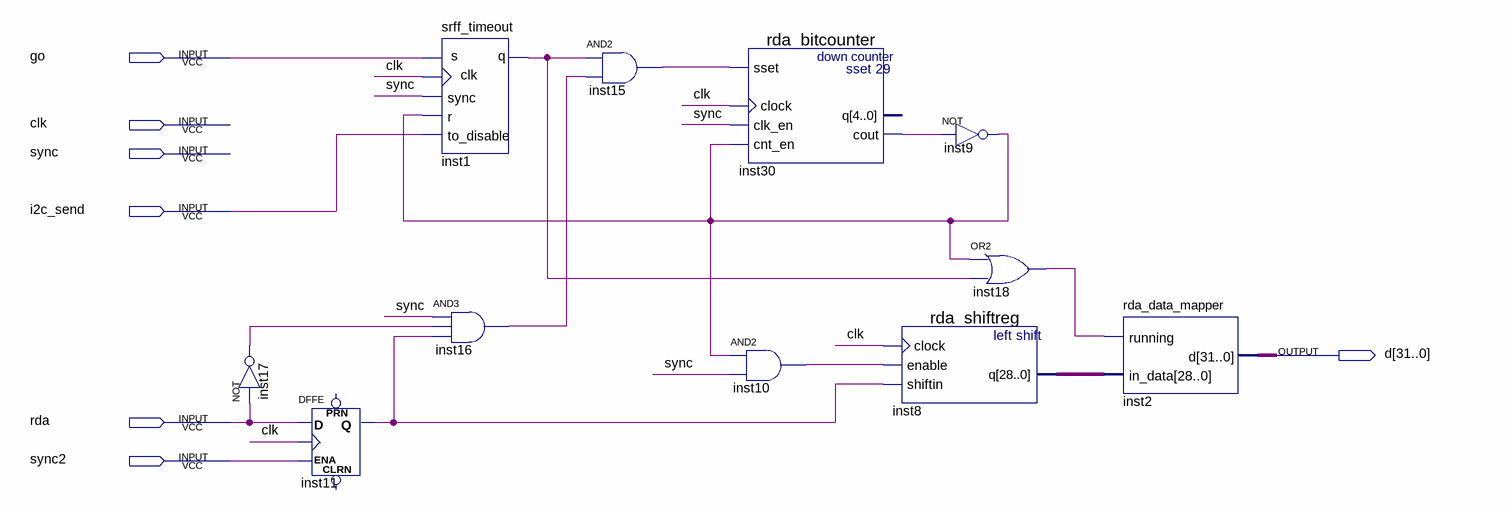
[diagram p0: schematic sheet]
// Quartus schematic i2c_readback.bdf as structural Verilog: 11 symbols, 7 pins
module i2c_readback (
  input  go,
  input  clk,
  input  sync,
  input  i2c_send,
  input  rda,
  input  sync2,
  output [31:0] d
);

  wire inst1_q, inst9_out, inst10_out, inst11_q, inst15_out, inst16_out, inst17_out, inst18_out, inst30_cout;
  wire [28:0] inst8_q;

  not inst17 (inst17_out, rda);
  DFFE inst11 (.D(rda), .CLK(clk), .ENA(sync2), .Q(inst11_q));  // open: PRN, CLRN
  srff_timeout inst1 (.clk(clk), .sync(sync), .to_disable(i2c_send), .s(go), .r(inst9_out), .q(inst1_q));
  and inst16 (inst16_out, sync, inst17_out, inst11_q);
  and inst15 (inst15_out, inst1_q, inst16_out);
  rda_bitcounter inst30 (
    .sset(inst15_out), .clock(clk), .clk_en(sync), .cnt_en(inst9_out), .cout(inst30_cout));  // open: q
  and inst10 (inst10_out, inst9_out, sync);
  rda_shiftreg inst8 (.clock(clk), .enable(inst10_out), .shiftin(inst11_q), .q(inst8_q));
  not inst9 (inst9_out, inst30_cout);
  or inst18 (inst18_out, inst9_out, inst1_q);
  rda_data_mapper inst2 (.running(inst18_out), .in_data(inst8_q), .d(d));
endmodule
